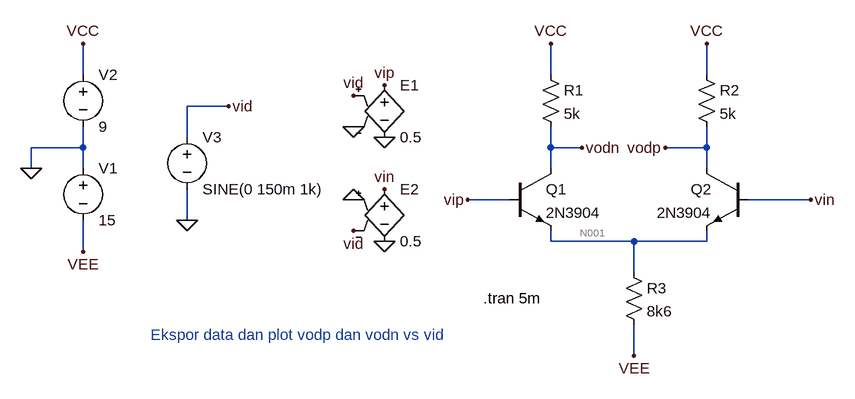
[diagram p0: schematic Perc-01-02-linearrange.asc]
Perc-01-02-linearrange.asc, the LTspice schematic file:
Version 4
SHEET 1 880 680
WIRE -320 -32 -320 -80
WIRE 400 -32 400 -80
WIRE 640 -32 640 -80
WIRE -96 16 -160 16
WIRE -160 64 -160 16
WIRE -320 80 -320 48
WIRE -320 80 -400 80
WIRE 400 80 400 48
WIRE 448 80 400 80
WIRE 640 80 640 48
WIRE 640 80 576 80
WIRE -400 112 -400 80
WIRE -320 112 -320 80
WIRE 400 112 400 80
WIRE 640 112 640 80
WIRE 336 160 272 160
WIRE 800 160 704 160
WIRE -160 192 -160 144
WIRE 400 224 400 208
WIRE 528 224 400 224
WIRE 640 224 640 208
WIRE 640 224 528 224
WIRE -320 240 -320 192
WIRE 528 272 528 224
WIRE 528 400 528 352
FLAG 400 -80 VCC
FLAG 640 -80 VCC
FLAG 528 400 VEE
FLAG 272 160 vip
FLAG 448 80 vodn
FLAG 576 80 vodp
FLAG -320 -80 VCC
FLAG -320 240 VEE
FLAG -400 112 0
FLAG -160 192 0
FLAG -96 16 vid
FLAG 144 64 0
FLAG 144 224 0
FLAG 96 48 0
FLAG 96 160 0
FLAG 96 0 vid
FLAG 96 208 vid
FLAG 144 -16 vip
FLAG 144 144 vin
FLAG 800 160 vin
SYMBOL npn 336 112 R0
SYMATTR InstName Q1
SYMATTR Value 2N3904
SYMBOL npn 704 112 M0
SYMATTR InstName Q2
SYMATTR Value 2N3904
SYMBOL res 384 -48 R0
SYMATTR InstName R1
SYMATTR Value 5k
SYMBOL res 624 -48 R0
SYMATTR InstName R2
SYMATTR Value 5k
SYMBOL res 512 256 R0
SYMATTR InstName R3
SYMATTR Value 8k6
SYMBOL voltage -320 96 R0
WINDOW 123 0 0 Left 0
WINDOW 39 0 0 Left 0
SYMATTR InstName V1
SYMATTR Value 15
SYMBOL voltage -320 -48 R0
WINDOW 123 0 0 Left 0
WINDOW 39 0 0 Left 0
SYMATTR InstName V2
SYMATTR Value 9
SYMBOL voltage -160 48 R0
WINDOW 123 0 0 Left 0
WINDOW 39 0 0 Left 0
SYMATTR InstName V3
SYMATTR Value SINE(0 150m 1k)
SYMBOL e 144 -32 R0
SYMATTR InstName E1
SYMATTR Value 0.5
SYMBOL e 144 128 R0
SYMATTR InstName E2
SYMATTR Value 0.5
TEXT 296 312 Left 2 !.tran 5m
TEXT -216 368 Left 2 ;Ekspor data dan plot vodp dan vodn vs vid

The netlist it stands for:
* Perc-01-02-linearrange.asc
Q1 vodn vip N001 0 2N3904
Q2 vodp vin N001 0 2N3904
R1 VCC vodn 5k
R2 VCC vodp 5k
R3 N001 VEE 8k6
V1 0 VEE 15
V2 VCC 0 9
V3 vid 0 SINE(0 150m 1k)
E1 vip 0 vid 0 0.5
E2 vin 0 0 vid 0.5
.model NPN NPN
.model PNP PNP
.lib standard.bjt
.tran 5m
* Ekspor data dan plot vodp dan vodn vs vid
.backanno
.end

* Results of the author's LTspice run, read from the files saved beside the schematic
* Operating Point, zero values left out:
*   V(vodn) = 4.842 V
*   V(n001) = -649.3 mV
*   V(vodp) = 4.842 V
*   V(vcc) = 9 V
*   V(vee) = -15 V
*   Ic(Q2) = 831.7 µA
*   Ib(Q2) = 2.65 µA
*   Ie(Q2) = -834.3 µA
*   Ic(Q1) = 831.7 µA
*   Ib(Q1) = 2.65 µA
*   Ie(Q1) = -834.3 µA
*   I(R3) = 1.669 mA
*   I(R2) = 831.7 µA
*   I(R1) = 831.7 µA
*   I(E2) = -2.65 µA
*   I(E1) = -2.65 µA
*   I(V2) = -1.663 mA
*   I(V1) = -1.669 mA
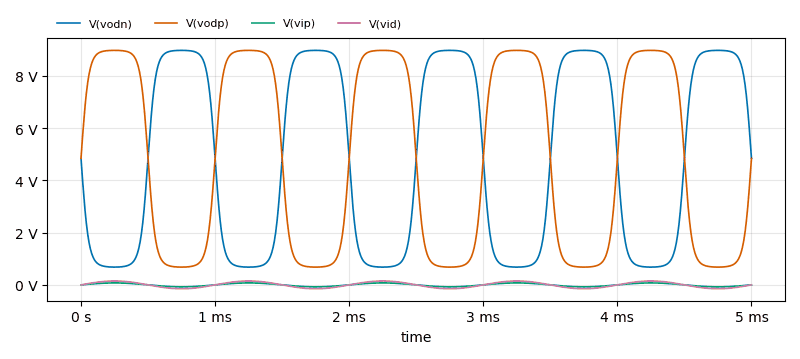
[diagram p1: Transient Analysis of Perc-01-02-linearrange.asc, plotted from the saved traces]
* Transient Analysis, 1 run:
*   V(vodn): min 679.7 mV, max 8.972 V, average 4.833 V, rms 6.044 V, last 4.843 V
*   V(vodp): min 679.7 mV, max 8.972 V, average 4.833 V, rms 6.044 V, last 4.84 V
*   V(vip): min -74.98 mV, max 74.98 mV, average -13.9 nV, rms 53.02 mV, last 0 V
*   V(vid): min -150 mV, max 150 mV, average -28.22 nV, rms 106.1 mV, last 0 V